# EAGLE schematic nixie-board (EAGLE 7.2.0)
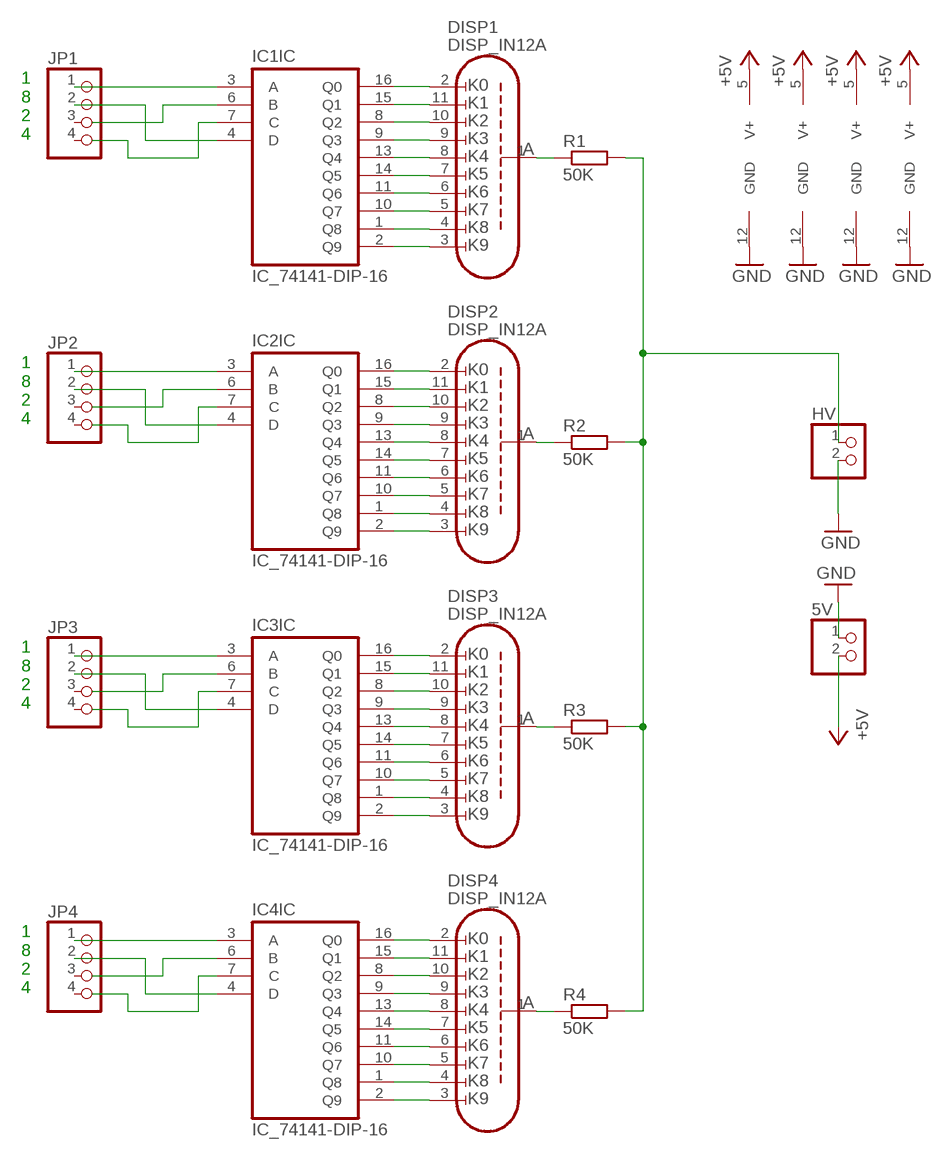
[diagram p0: schematic, sheet 1]

## Parts
5V  PINHD-1X2  [1X02]
DISP1  DISP_IN12A  [DISP_IN-12_SOCKET]
DISP2  DISP_IN12A  [DISP_IN-12_SOCKET]
DISP3  DISP_IN12A  [DISP_IN-12_SOCKET]
DISP4  DISP_IN12A  [DISP_IN-12_SOCKET]
HV  PINHD-1X2  [1X02]
IC1  IC_74141-DIP-16  [DIL16]
IC2  IC_74141-DIP-16  [DIL16]
IC3  IC_74141-DIP-16  [DIL16]
IC4  IC_74141-DIP-16  [DIL16]
IC5  IC_74141-DIP-16  [DIL16]
IC6  IC_74141-DIP-16  [DIL16]
IC7  IC_74141-DIP-16  [DIL16]
JP1  PINHD-1X4  [1X04]
JP2  PINHD-1X4  [1X04]
JP3  PINHD-1X4  [1X04]
JP4  PINHD-1X4  [1X04]
R1  50K  R-EU_0207/12  [0207/12]
R2  50K  R-EU_0207/12  [0207/12]
R3  50K  R-EU_0207/12  [0207/12]
R4  50K  R-EU_0207/12  [0207/12]

## Nets
+5V: 5V.2 IC1.5(SUPPLY:V+) IC5.5(SUPPLY:V+) IC6.5(SUPPLY:V+) IC7.5(SUPPLY:V+)
GND: 5V.1 HV.2 IC1.12(SUPPLY:GND) IC5.12(SUPPLY:GND) IC6.12(SUPPLY:GND) IC7.12(SUPPLY:GND)
N$1: DISP1.2(K0) IC1.16(IC:Q0)
N$2: DISP1.11(K1) IC1.15(IC:Q1)
N$3: DISP1.10(K2) IC1.8(IC:Q2)
N$4: DISP1.9(K3) IC1.9(IC:Q3)
N$5: DISP1.8(K4) IC1.13(IC:Q4)
N$6: DISP1.7(K5) IC1.14(IC:Q5)
N$7: DISP1.6(K6) IC1.11(IC:Q6)
N$8: DISP1.5(K7) IC1.10(IC:Q7)
N$9: DISP1.4(K8) IC1.1(IC:Q8)
N$10: DISP1.3(K9) IC1.2(IC:Q9)
N$11: IC1.3(IC:A) JP1.1
N$12: IC1.4(IC:D) JP1.2
N$13: IC1.6(IC:B)
N$14: IC1.7(IC:C)
N$15: DISP2.2(K0) IC2.16(IC:Q0)
N$16: DISP2.11(K1) IC2.15(IC:Q1)
N$17: DISP1.1(ANODE) R1.1
N$18: DISP2.10(K2) IC2.8(IC:Q2)
N$19: DISP2.9(K3) IC2.9(IC:Q3)
N$20: DISP2.8(K4) IC2.13(IC:Q4)
N$21: DISP2.7(K5) IC2.14(IC:Q5)
N$22: DISP2.6(K6) IC2.11(IC:Q6)
N$23: DISP2.5(K7) IC2.10(IC:Q7)
N$24: DISP2.4(K8) IC2.1(IC:Q8)
N$25: DISP2.3(K9) IC2.2(IC:Q9)
N$26: DISP2.1(ANODE) R2.1
N$27: IC2.3(IC:A) JP2.1
N$28: IC2.4(IC:D) JP2.2
N$29: IC2.6(IC:B)
N$30: IC2.7(IC:C)
N$31: DISP3.2(K0) IC3.16(IC:Q0)
N$32: DISP3.11(K1) IC3.15(IC:Q1)
N$33: DISP3.10(K2) IC3.8(IC:Q2)
N$34: DISP3.9(K3) IC3.9(IC:Q3)
N$35: DISP3.8(K4) IC3.13(IC:Q4)
N$36: DISP3.7(K5) IC3.14(IC:Q5)
N$37: DISP3.6(K6) IC3.11(IC:Q6)
N$38: DISP3.5(K7) IC3.10(IC:Q7)
N$39: DISP3.4(K8) IC3.1(IC:Q8)
N$40: DISP3.3(K9) IC3.2(IC:Q9)
N$41: DISP3.1(ANODE) R3.1
N$42: IC3.3(IC:A) JP3.1
N$43: IC3.4(IC:D) JP3.2
N$44: IC3.6(IC:B)
N$45: IC3.7(IC:C)
N$46: DISP4.2(K0) IC4.16(IC:Q0)
N$47: DISP4.11(K1) IC4.15(IC:Q1)
N$48: DISP4.10(K2) IC4.8(IC:Q2)
N$49: DISP4.9(K3) IC4.9(IC:Q3)
N$50: DISP4.8(K4) IC4.13(IC:Q4)
N$51: DISP4.7(K5) IC4.14(IC:Q5)
N$52: DISP4.6(K6) IC4.11(IC:Q6)
N$53: DISP4.5(K7) IC4.10(IC:Q7)
N$54: DISP4.4(K8) IC4.1(IC:Q8)
N$55: DISP4.3(K9) IC4.2(IC:Q9)
N$56: DISP4.1(ANODE) R4.1
N$57: IC4.3(IC:A) JP4.1
N$58: IC4.4(IC:D) JP4.2
N$59: IC4.6(IC:B)
N$60: IC4.7(IC:C)
N$62: HV.1 R1.2 R2.2 R3.2 R4.2
Unconnected: IC2.5(SUPPLY:V+) IC2.12(SUPPLY:GND) IC3.5(SUPPLY:V+) IC3.12(SUPPLY:GND) IC4.5(SUPPLY:V+) IC4.12(SUPPLY:GND) IC5.1(IC:Q8) IC5.2(IC:Q9) IC5.3(IC:A) IC5.4(IC:D) IC5.6(IC:B) IC5.7(IC:C) IC5.8(IC:Q2) IC5.9(IC:Q3) IC5.10(IC:Q7) IC5.11(IC:Q6) IC5.13(IC:Q4) IC5.14(IC:Q5) IC5.15(IC:Q1) IC5.16(IC:Q0) IC6.1(IC:Q8) IC6.2(IC:Q9) IC6.3(IC:A) IC6.4(IC:D) IC6.6(IC:B) IC6.7(IC:C) IC6.8(IC:Q2) IC6.9(IC:Q3) IC6.10(IC:Q7) IC6.11(IC:Q6) IC6.13(IC:Q4) IC6.14(IC:Q5) IC6.15(IC:Q1) IC6.16(IC:Q0) IC7.1(IC:Q8) IC7.2(IC:Q9) IC7.3(IC:A) IC7.4(IC:D) IC7.6(IC:B) IC7.7(IC:C) IC7.8(IC:Q2) IC7.9(IC:Q3) IC7.10(IC:Q7) IC7.11(IC:Q6) IC7.13(IC:Q4) IC7.14(IC:Q5) IC7.15(IC:Q1) IC7.16(IC:Q0) JP1.3 JP1.4 JP2.3 JP2.4 JP3.3 JP3.4 JP4.3 JP4.4

## Notes on the sheet
- 1
  8
  2
  4
- 1
  8
  2
  4
- 1
  8
  2
  4
- 1
  8
  2
  4

## Library data of the parts
5V HV = pinhead:PINHD-1X2: PIN HEADER
DISP1-DISP4 = dp_devices_fixed:DISP_IN12A: IN-12A Nixie Display
IC1-IC7 = dp_devices_fixed:IC_74141: BCD to decimal decoder
JP1-JP4 = pinhead:PINHD-1X4: PIN HEADER
R1-R4 = rcl:R-EU_: RESISTOR, European symbol